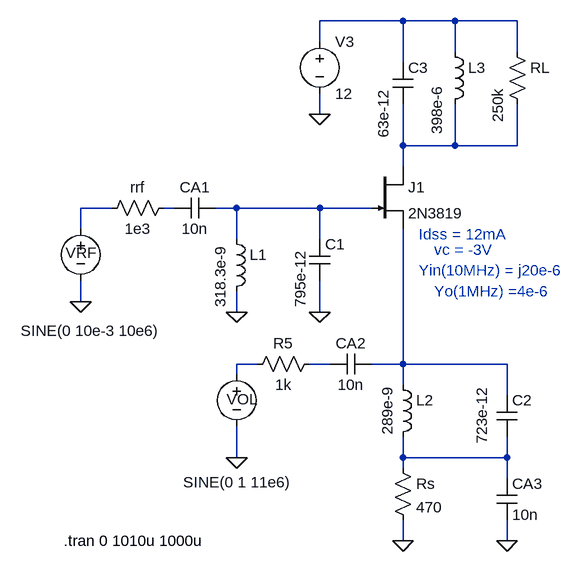
[diagram p0: schematic mezclador_jfet.asc]
mezclador_jfet.asc, the LTspice schematic file:
Version 4
SHEET 1 2292 680
WIRE 416 -656 288 -656
WIRE 496 -656 416 -656
WIRE 592 -656 496 -656
WIRE 288 -624 288 -656
WIRE 496 -608 496 -656
WIRE 592 -608 592 -656
WIRE 416 -592 416 -656
WIRE 288 -512 288 -544
WIRE 416 -464 416 -528
WIRE 496 -464 496 -528
WIRE 496 -464 416 -464
WIRE 592 -464 592 -528
WIRE 592 -464 496 -464
WIRE 416 -432 416 -464
WIRE -32 -368 -80 -368
WIRE 64 -368 48 -368
WIRE 160 -368 128 -368
WIRE 288 -368 160 -368
WIRE 368 -368 288 -368
WIRE -80 -336 -80 -368
WIRE 160 -320 160 -368
WIRE 288 -320 288 -368
WIRE -80 -224 -80 -256
WIRE 160 -208 160 -240
WIRE 288 -208 288 -256
WIRE 192 -128 160 -128
WIRE 304 -128 272 -128
WIRE 416 -128 416 -336
WIRE 416 -128 368 -128
WIRE 576 -128 416 -128
WIRE 160 -112 160 -128
WIRE 416 -96 416 -128
WIRE 576 -80 576 -128
WIRE 160 16 160 -32
WIRE 416 16 416 -16
WIRE 576 16 576 -16
WIRE 576 16 416 16
WIRE 416 32 416 16
WIRE 576 48 576 16
WIRE 416 144 416 112
WIRE 576 144 576 112
FLAG 416 144 0
FLAG 160 16 0
FLAG -80 -224 0
FLAG 160 -208 0
FLAG 288 -208 0
FLAG 576 144 0
FLAG 288 -512 0
SYMBOL ind 400 -112 R0
WINDOW 3 -8 93 VLeft 2
SYMATTR InstName L2
SYMATTR Value 289e-9
SYMBOL cap 560 -80 R0
WINDOW 3 -23 75 VLeft 2
SYMATTR InstName C2
SYMATTR Value 723e-12
SYMBOL cap 368 -144 R90
WINDOW 0 0 32 VBottom 2
WINDOW 3 32 32 VTop 2
SYMATTR InstName CA2
SYMATTR Value 10n
SYMBOL voltage 160 -128 R0
WINDOW 123 0 0 Left 0
WINDOW 39 0 0 Left 0
WINDOW 0 -15 54 Left 2
WINDOW 3 -82 182 Left 2
SYMATTR InstName VOL
SYMATTR Value SINE(0 1 11e6)
SYMBOL res 64 -384 R90
WINDOW 0 0 56 VBottom 2
WINDOW 3 32 56 VTop 2
SYMATTR InstName rrf
SYMATTR Value 1e3
SYMBOL cap 128 -384 R90
WINDOW 0 0 32 VBottom 2
WINDOW 3 32 32 VTop 2
SYMATTR InstName CA1
SYMATTR Value 10n
SYMBOL cap 272 -320 R0
WINDOW 3 -14 105 VLeft 2
SYMATTR InstName C1
SYMATTR Value 795e-12
SYMBOL ind 144 -336 R0
WINDOW 3 -9 121 VLeft 2
SYMATTR InstName L1
SYMATTR Value 318.3e-9
SYMBOL ind 480 -624 R0
WINDOW 3 -12 143 VLeft 2
SYMATTR InstName L3
SYMATTR Value 398e-6
SYMBOL res 576 -624 R0
WINDOW 3 -14 72 VRight 2
SYMATTR InstName RL
SYMATTR Value 250k
SYMBOL voltage -80 -352 R0
WINDOW 123 0 0 Left 0
WINDOW 39 0 0 Left 0
WINDOW 0 -23 53 Left 2
WINDOW 3 -92 173 Left 2
SYMATTR InstName VRF
SYMATTR Value SINE(0 10e-3 10e6)
SYMBOL res 400 16 R0
SYMATTR InstName Rs
SYMATTR Value 470
SYMBOL cap 560 48 R0
SYMATTR InstName CA3
SYMATTR Value 10n
SYMBOL res 288 -144 R90
WINDOW 0 0 56 VBottom 2
WINDOW 3 32 56 VTop 2
SYMATTR InstName R5
SYMATTR Value 1k
SYMBOL voltage 288 -640 R0
WINDOW 123 0 0 Left 0
WINDOW 39 0 0 Left 0
SYMATTR InstName V3
SYMATTR Value 12
SYMBOL njf 368 -432 R0
SYMATTR InstName J1
SYMATTR Value 2N3819
SYMBOL cap 400 -592 R0
WINDOW 3 -14 116 VLeft 2
SYMATTR InstName C3
SYMATTR Value 63e-12
TEXT -106 144 Left 2 !.tran 0 1010u 1000u
TEXT 440 -328 Left 2 ;Idss = 12mA
TEXT 464 -304 Left 2 ;vc = -3V
TEXT 440 -272 Left 2 ;Yin(10MHz) = j20e-6
TEXT 464 -240 Left 2 ;Yo(1MHz) =4e-6

The netlist it stands for:
* mezclador_jfet.asc
L2 N008 N009 289e-9
C2 N008 N009 723e-12
CA2 N008 N007 10n
VOL N006 0 SINE(0 1 11e6)
rrf N004 N003 1e3
CA1 N005 N004 10n
C1 N005 0 795e-12
L1 N005 0 318.3e-9
L3 N001 N002 398e-6
RL N001 N002 250k
VRF N003 0 SINE(0 10e-3 10e6)
Rs N009 0 470
CA3 N009 0 10n
R5 N007 N006 1k
V3 N001 0 12
J1 N002 N005 N008 2N3819
C3 N001 N002 63e-12
.model NJF NJF
.model PJF PJF
.lib standard.jft
.tran 0 1010u 1000u
* Idss = 12mA
* vc = -3V
* Yin(10MHz) = j20e-6
* Yo(1MHz) =4e-6
.backanno
.end